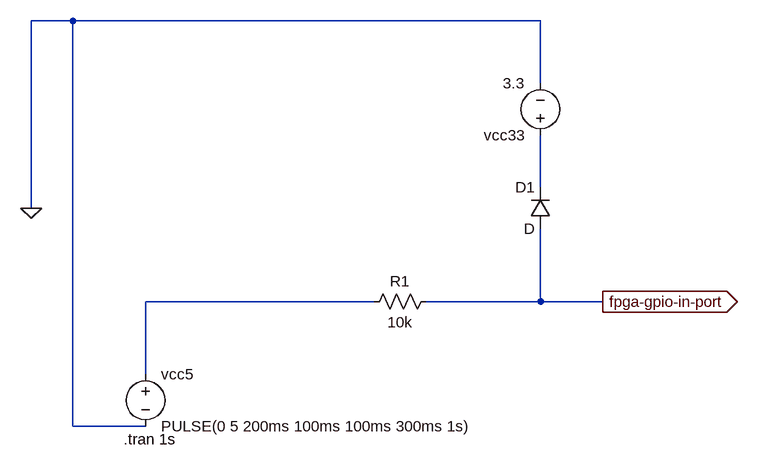
[diagram p0: schematic bread-board-5to33-test01.asc]
bread-board-5to33-test01.asc, the LTspice schematic file:
Version 4
SHEET 1 880 712
WIRE -400 -224 -464 -224
WIRE 320 -224 -400 -224
WIRE 320 -128 320 -224
WIRE 320 32 320 -48
WIRE -464 64 -464 -224
WIRE 64 208 -288 208
WIRE 320 208 320 96
WIRE 320 208 144 208
WIRE 416 208 320 208
WIRE -288 320 -288 208
WIRE -400 400 -400 -224
WIRE -288 400 -400 400
FLAG 416 208 fpga-gpio-in-port
IOPIN 416 208 Out
FLAG -464 64 0
SYMBOL voltage -288 304 R0
WINDOW 123 0 0 Left 2
WINDOW 39 0 0 Left 2
SYMATTR InstName vcc5
SYMATTR Value PULSE(0 5 200ms 100ms 100ms 300ms 1s)
SYMBOL voltage 320 -32 R180
WINDOW 123 0 0 Left 2
WINDOW 39 0 0 Left 2
SYMATTR InstName vcc33
SYMATTR Value 3.3
SYMBOL res 160 192 R90
WINDOW 0 0 56 VBottom 2
WINDOW 3 32 56 VTop 2
SYMATTR InstName R1
SYMATTR Value 10k
SYMBOL diode 336 96 R180
WINDOW 0 24 64 Left 2
WINDOW 3 24 0 Left 2
SYMATTR InstName D1
TEXT -322 420 Left 2 !.tran 1s

The netlist it stands for:
* bread-board-5to33-test01.asc
vcc5 N002 0 PULSE(0 5 200ms 100ms 100ms 300ms 1s)
vcc33 N001 0 3.3
R1 fpga-gpio-in-port N002 10k
D1 fpga-gpio-in-port N001 D
.model D D
.lib standard.dio
.tran 1s
.backanno
.end